# Altium schematic sheet 7_Peripherals.SchDoc
size A4
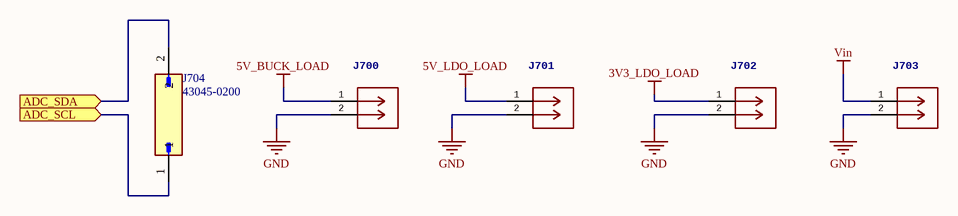
[diagram p0: 7_Peripherals.SchDoc]

## Parts
J700  05325-90229  [MOLEX_532590229]  (value not drawn)
J701  05325-90229  [MOLEX_532590229]  (value not drawn)
J702  05325-90229  [MOLEX_532590229]  (value not drawn)
J703  05325-90229  [MOLEX_532590229]  (value not drawn)
J704  43045-0200  [MOLEX_43045-0200]

## Ports
ADC_SCL (in), ADC_SDA (in)

## Nets
3V3_LDO_LOAD: J702.1
5V_BUCK_LOAD: J700.1
5V_LDO_LOAD: J701.1
GND: J700.2 J701.2 J702.2 J703.2
Vin: J703.1
ADC_SCL: J704.1 ; port ADC_SCL
ADC_SDA: J704.2 ; port ADC_SDA

## Library data of the parts
J700-J703 = 0532590229: Molex Mighty-SPOX 2POS; DeviceSetName: 532590229; Manufacturer: Molex; PartNumber: 532590229; SupplierNumber: WM14648-ND; SuppliersPartNumber: *; Link: https://www.digikey.ca/en/products/detail/molex/0532590229/3263134?s=N4IgTCBcDaIKwGYxwJwAYxhSAugXyA
J704 = 43045-0200: Molex Microfit 2POS; SupplerNumber: WM1813-ND; MF: Molex; Digi-Key_Part_Number: WM1813-ND; SnapEDA_Link: https://www.snapeda.com/parts/43045-0200/Molex/view-part/?ref=snap; Purchase-URL: https://pricing.snapeda.com/search/part/43045-0200/?ref=eda; Package: None; MP: 43045-0200; Check_prices: https://www.snapeda.com/parts/43045-0200/Molex/view-part/?ref=eda; Value: *; PartNumber: 43045-0200; Link: https://www.digikey.ca/en/products/detail/molex/0430450200/252526?s=N4IgTCBcDaICwGYAMcCsBaJYlJAXQF8g